# Altium project PCB-Tester-Board-V1.PrjPcb (part 2 of 4)

## Sheet PSU3.SchDoc: PCB-Tester PSU3
size A4; Date: JUN 2020; CheckedBy: Moerz, Hoeren; Author: Rudziński; CompanyName: TDK-Micronas GmbH; DrawnBy: Rudziński; Engineer: Rudziński; Organization: Test Engineering; Address1: Hans-Bunte-Strasse 19; Address2: D-79108 Freiburg; Address3: Germany; DocumentNumber: U33110; Revision: V1.0; SheetNumber: 15; SheetTotal: 18; DateDraw: JUN 2020; DateChecked: 2020-06-19; Workspace: Workspace; TitleTyp: Title-Typ; PageSetup: Record=PageOptions|CenterHorizontal=True|CenterVertical=True|PrintScale=0.97|XCorrection=1.00|YCorrection=1.00|PrintKind=0|BorderSize=5000000|LeftOffset=0|BottomOffset=0|Orientation=2|PaperLength=1000|PaperWidth=1000|Scale=100|PaperSource=7|PrintQuality=-3|MediaType=1|DitherType=10|PrintScaleMode=1|PaperKind=A4|PaperIndex=9
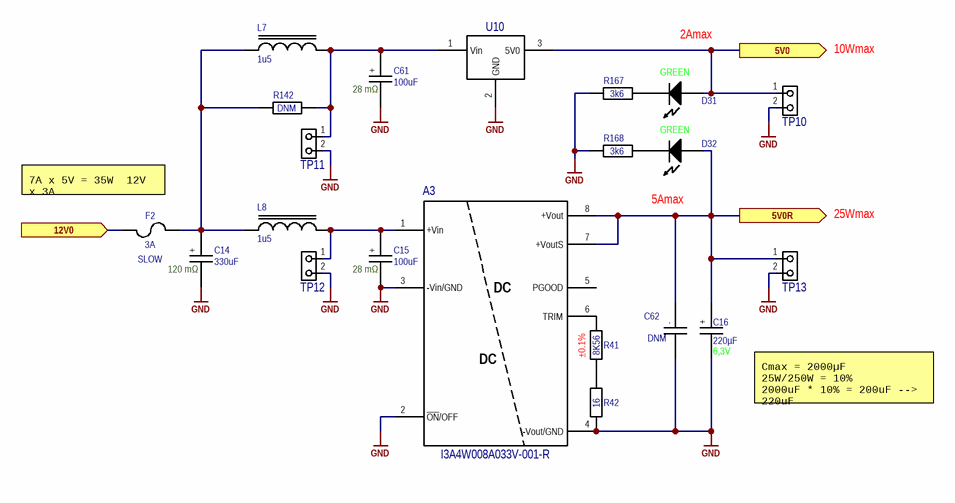
[diagram p5: PSU3.SchDoc]

### Parts
A3  A  [I3A-POSETIVE]  (value not drawn)
C14  value 330uF  ESR: 120 mΩ  [SMD-CAP-ALU-G]  (hidden comment: C+)
C15  value 100uF  ESR: 28 mΩ  [SMD-CAP-ALU-G]  (hidden comment: C+)
C16  value 220µF  Voltage Rating: 6,3V  [SMD-CAP-ALU-E]  (hidden comment: C+)
C61  value 100uF  ESR: 28 mΩ  [SMD-CAP-ALU-G]  (hidden comment: C+)
C62  value DNM  [C0402 Reflow]  (hidden comment: C)  (no BOM)
D31  Color: GREEN  [L0603G]  (hidden comment: D)
D32  Color: GREEN  [L0603G]  (hidden comment: D)
F2  value 3A  Speed: SLOW  [OMNI-Fuse]  (hidden comment: F)
L7  Inductance: 1u5  [XAL4020]  (hidden comment: L)
L8  Inductance: 1u5  [XAL4020]  (hidden comment: L)
R41  value 8K56  Tolerance: ±0.1%  [R0603 Reflow]  (hidden comment: R)
R42  value 16  [R0603 Reflow]  (hidden comment: R)
R142  value DNM  [R1206 Reflow]  (hidden comment: R)  (no BOM)
R167  value 3k6  [R0603 Reflow]  (hidden comment: R)
R168  value 3k6  [R0603 Reflow]  (hidden comment: R)
TP10  TP  [DualTestpoint 100mils]  (value not drawn)  (no BOM)
TP11  TP  [DualTestpoint 100mils]  (value not drawn)  (no BOM)
TP12  TP  [DualTestpoint 100mils]  (value not drawn)  (no BOM)
TP13  TP  [DualTestpoint 100mils]  (value not drawn)  (no BOM)
U10  U  [3SIP Traco]  (value not drawn)

### Ports
5V0 (out), 5V0R (out), 12V0 (in)

### Nets
5V0: D31.1(Anode) TP10.1 U10.3(5V0) ; port 5V0
5V0R: A3.7(+VoutS) A3.8(+Vout) C16.1 C62.1 D32.1(Anode) TP13.1 ; port 5V0R
12V0: F2.1 ; port 12V0
GND: A3.2(~{ON}/OFF) A3.3(-Vin/GND) A3.4(-Vout/GND) C14.2 C15.2 C16.2 C61.2 C62.2 R42.1 R167.1 R168.1 TP10.2 TP11.2 TP12.2 TP13.2 U10.2(GND)
NetA3_1: A3.1(+Vin) C15.1 L8.1 TP12.1
NetA3_6: A3.6(TRIM) R41.2
NetC14_1: C14.1 F2.2 L7.2 L8.2 R142.1
NetC61_1: C61.1 L7.1 R142.2 TP11.1 U10.1(Vin)
NetD31_2: D31.2(Cathode) R167.2
NetD32_2: D32.2(Cathode) R168.2
NetR41_1: R41.1 R42.2

Not connected (* = marked no-connect by the designer): A3 5(PGOOD)

### Notes on the sheet
- 2Amax
- 10Wmax
- (near F2) 7A x 5V = 35W  12V x 3A
- 5Amax
- 25Wmax
- (near C16) Cmax = 2000µF
  25W/250W = 10%
  2000uF * 10% = 200uF --> 220uF
- designed by
- reviewed by
- last drawn by
- Project:
- Schematic:
- last printed
- DIN-A4 L
- sheets
- of
- File:
- (in symbol C) .
- (in symbol C+) +
- (in symbol i3A4W008A033V-001-R) DC

### Library data of the parts
A3 = i3A4W008A033V-001-R: DC DC CONVERTER 3.3-16.5V; 04. Manufacturer: TDK-Lambda Americas Inc.; 03. Unit Price: 20.58; 13. Created Date/Name: AUG 2018 / Hören; 01. Distributor: DigiKey; 02. Distributor Part Number: 285-2720-ND; 07. Manufacturer  Part Number: I3A4W008A033V-001-R; 11. RoHS: YES; ComponentLink1Description: Info; ComponentLink1URL: https://www.digikey.de/products/en?keywords=I3A4W008A033V-001-R; ComponentLink2Description: DataSheet; ComponentLink2URL: https://www.us.tdk-lambda.com/ftp/specs/i3a_full_datasheet.pdf?ref_disty=digikey; NicName: I3A4W008A033V-001-R
C14 = C+: CAP ALUM 330UF 20% 50V SMD; 04. Manufacturer: Panasonic Electronic Components; 07. Manufacturer  Part Number: EEE-FT1H331AP; 03. Unit Price: 0.96; 13. Created Date/Name: AUG2018/Hören; 3D-Export: No; ComponentLink1Description: Info; ComponentLink1URL: https://www.digikey.de/product-detail/en/panasonic-electronic-components/EEE-FT1H331AP/PCE5026DKR-ND/2652105; Tolerance: ±20%; Voltage Rating: 50V; 02. Distributor Part Number: PCE5026DKR-ND; 09. Operating Temperature: -55°C ~ 105°C; 11. RoHS: YES; 01. Distributor: DigiKey; ComponentLink2Description: DataSheet; ComponentLink2URL: https://industrial.panasonic.com/cdbs/www-data/pdf/RDE0000/ABA0000C1240.pdf
C15 C61 = C+: CAP ALUM POLY HYB 100UF 50V SMD; 04. Manufacturer: Panasonic Electronic Components; 07. Manufacturer  Part Number: EEH-ZA1H101P; Tolerance: ±20%; 03. Unit Price: 2.5; 13. Created Date/Name: AUG2018/Hören; 3D-Export: No; ComponentLink1Description: Info; ComponentLink1URL: https://www.digikey.de/product-detail/en/panasonic-electronic-components/EEH-ZA1H101P/P15442DKR-ND/3088152; Voltage Rating: 50V; 02. Distributor Part Number: P15442DKR-ND; 09. Operating Temperature: -55°C ~ 105°C; 11. RoHS: YES; 01. Distributor: DigiKey; ComponentLink2Description: DataSheet; ComponentLink2URL: https://industrial.panasonic.com/cdbs/www-data/pdf/RDD0000/ABA0000C1221.pdf
C16 = C+: CAP ALUM 220UF 20% 6.3V SMD; 04. Manufacturer: Panasonic Electronic Components; 07. Manufacturer  Part Number: EEE-FC0J221P; ESR: 400 mΩ; Type: Radial, Can - SMD; 03. Unit Price: 0.57; 13. Created Date/Name: AUG2018/Hören; Lifetime @ Temp: 1000 Hrs @ 105°C; 3D-Export: No; ComponentLink1Description: Info; ComponentLink1URL: https://www.digikey.de/product-detail/en/panasonic-electronic-components/EEE-FC0J221P/PCE3985DKR-ND/1806511; Tolerance: ±20%; 02. Distributor Part Number: PCE3985DKR-ND; 09. Operating Temperature: -40°C ~ 105°C; 11. RoHS: YES; 01. Distributor: DigiKey; ComponentLink2Description: DataSheet; ComponentLink2URL: https://industrial.panasonic.com/cdbs/www-data/pdf/RDE0000/ABA0000C1172.pdf; Package: Ø8mm x 6.2mm
C62 = C: CAP CER 0.1UF 16V X7R 0402; 04. Manufacturer: KEMET; 07. Manufacturer  Part Number: C0402C104J4RACTU; Tolerance: ±5%; 03. Unit Price: 0.45; 13. Created Date/Name: AUG2018/Hören; Voltage Rating: 16V; Type: X7R; ComponentLink1Description: Info; ComponentLink1URL: https://www.digikey.de/product-detail/en/kemet/C0402C104J4RACTU/399-7761-6-ND/3472292; 02. Distributor Part Number: 399-7761-6-ND; 09. Operating Temperature: -55°C ~ 125°C; 11. RoHS: YES; 01. Distributor: DigiKey; ComponentLink2Description: DataSheet; ComponentLink2URL: https://content.kemet.com/datasheets/KEM_C1002_X7R_SMD.pdf; Package: 0402
D31 D32 = LED: LED GREEN DIFFUSED 0603 SMD; 04. Manufacturer: OSRAM Opto Semiconductors Inc.; 07. Manufacturer  Part Number: LG L29K-G2J1-24-Z; Vf: 1.7V; If: 2mA; Wave Length: 570nm; Viewing Angle: 160°; 03. Unit Price: 0.4; 13. Created Date/Name: AUG2018/Hören; ComponentLink1Description: Info; ComponentLink1URL: https://www.digikey.de/products/en?keywords=475-2709-6-ND; ComponentLink2Description: DataSheet; ComponentLink2URL: https://www.digikey.de/products/en?keywords=475-2709-6-ND; 02. Distributor Part Number: 475-2709-6-ND; 11. RoHS: YES; 01. Distributor: DigiKey
F2 = Fuse: FUSE BOARD MNT 3A 125VAC/VDC SMD; 04. Manufacturer: Littelfuse Inc.; 07. Manufacturer  Part Number: 0154003.DRTL; 03. Unit Price: 2.84; 13. Created Date/Name: AUG 2018 / Hören; 3D-Export: No; 01. Distributor: DigiKey; 02. Distributor Part Number: F10747DKR-ND; 09. Operating Temperature: -55°C ~ 125°C; 11. RoHS: YES; ComponentLink1Description: Info; ComponentLink1URL: https://www.digikey.de/product-detail/en/littelfuse-inc/0154003.DRTL/F10747DKR-ND/8109626; ComponentLink2Description: DataSheet; ComponentLink2URL: https://www.littelfuse.com/~/media/electronics/datasheets/fuses/littelfuse_fuse_154_154t_154l_154tl_datasheet.pdf.pdf
L7 L8 = INDUCTOR: Fixed Inductors 1.5uH Shld 20% 7.5A 23.6mOhms AECQ2; 04. Manufacturer: Coilcraft; 07. Manufacturer  Part Number: XAL4020-152MEC; Impedance Tolerance: %; 03. Unit Price: 1.75; ComponentLink1Description: Info; ComponentLink1URL: https://www.digikey.de/products/en?keywords=732-1620-6-ND; ComponentLink2Description: DataSheet; ComponentLink2URL: https://www.we-online.de/katalog/datasheet/742792040.pdf; 02. Distributor Part Number: 994-XAL4020-152MEC; 11. RoHS: YES; Tolerance: *; Value: *; 01. Distributor: Mouser
R41 = R: RES 8.56K OHM 0.1% 1/8W 0603; 04. Manufacturer: Vishay Dale; 07. Manufacturer  Part Number: TNPW06038K56BEEA; 03. Unit Price: 0.56; 13. Created Date/Name: AUG2018/Hören; Power Rating: 125mW; 3D-Export: No; ComponentLink1URL: https://www.digikey.de/products/en/resistors/chip-resistor-surface-mount/52?k=&pkeyword=&sv=0&pv2085=u8.56+kOhms&pv3=370&sf=0&FV=ffe00034%2C1c00f3%2C1f140000&quantity=&ColumnSort=0&page=1&pageSize=25; ComponentLink1Description: Info; 02. Distributor Part Number: 541-4554-6-ND; 09. Operating Temperature: -55°C ~ 155°C; 11. RoHS: YES; 01. Distributor: DigiKey; ComponentLink2Description: DataSheet; ComponentLink2URL: http://www.vishay.com/docs/28758/tnpw_e3.pdf; Type: Thin Film; Package: 0603
R42 = R: RES SMD 16 OHM 1% 1/10W 0603; 04. Manufacturer: Yageo; 07. Manufacturer  Part Number: RC0603FR-0716RL; 03. Unit Price: 0.09; 13. Created Date/Name: AUG2018/Hören; Power Rating: 100mW; 3D-Export: No; Tolerance: ±1%; ComponentLink1URL: https://www.digikey.de/product-detail/en/yageo/RC0603FR-0716RL/311-16.0HRDKR-ND/732858; ComponentLink1Description: Info; 02. Distributor Part Number: 311-16.0HRDKR-ND; 09. Operating Temperature: -55°C ~ 155°C; 11. RoHS: YES; 01. Distributor: DigiKey; ComponentLink2Description: DataSheet; ComponentLink2URL: http://www.yageo.com/documents/recent/PYu-RC_Group_51_RoHS_L_10.pdf; Type: Thick Film; Package: 0603
R142 = R_25: RES SMD 0 OHM JUMPER 1206; ComponentLink1URL: https://www.digikey.de/products/en?keywords=311-0.0JRDKR-ND; ComponentLink1Description: Info; 11. RoHS: YES; ComponentLink2Description: DataSheet; Package: 1206
R167 R168 = R: RES SMD 3.6K OHM 1% 1/10W 0603; 04. Manufacturer: Yageo; 07. Manufacturer  Part Number: RC0603FR-073K6L; 03. Unit Price: 0.09; 13. Created Date/Name: AUG2018/Hören; Power Rating: 63mW; Tolerance: ±1%; ComponentLink1URL: https://www.digikey.de/product-detail/en/yageo/RC0402FR-071K65L/YAG3043DKR-ND/5282914; ComponentLink1Description: Info; 02. Distributor Part Number: 311-3.60KHRCT-ND; 09. Operating Temperature: -55°C ~ 155°C; 11. RoHS: YES; 01. Distributor: DigiKey; ComponentLink2Description: DataSheet; Type: Thick Film; Package: 0402
TP10-TP13 = DualTestpoint 100mils: as TP3 on sheet Power; 01. Distributor: Samtec Inc.; 02. Distributor Part Number: HMTSW-103-07-G-S-240; 11. RoHS: YES; ComponentLink1Description: Info; ComponentLink1URL: https://www.samtec.com/products/hmtsw-103-07-g-s-240; ComponentLink2Description: DataSheet; ComponentLink2URL: http://suddendocs.samtec.com/catalog_english/hmtsw.pdf
U10 = TSR 2-2450: DC DC CONVERTER 5V 10W; 04. Manufacturer: Traco Power; 03. Unit Price: 11.31; 13. Created Date/Name: AUG 2018 / Hören; 01. Distributor: DigiKey; 02. Distributor Part Number: 1951-2692-ND; 07. Manufacturer  Part Number: TSR 2-2450; 11. RoHS: YES; ComponentLink1Description: Info; ComponentLink1URL: https://www.digikey.de/products/en/power-supplies-board-mount/dc-dc-converters/922?k=TSR2&k=&pkeyword=TSR2&sv=0&pv1525=249171&sf=0&FV=-8%7C922&quantity=&ColumnSort=0&page=1&pageSize=25; ComponentLink2Description: DataSheet; ComponentLink2URL: https://www.tracopower.com/products/tsr2.pdf; Package: 3SIP

## Sheet DC-Cable.SchDoc: PCB-Tester ADC
size A4; Date: JUN 2020; CheckedBy: Moerz, Hoeren; Author: Rudziński; CompanyName: TDK-Micronas GmbH; DrawnBy: Rudziński; Engineer: Rudziński; Organization: Test Engineering; Address1: Hans-Bunte-Strasse 19; Address2: D-79108 Freiburg; Address3: Germany; DocumentNumber: U33110; Revision: V1.0; SheetNumber: 5; SheetTotal: 20; DateDraw: JUN 2020; DateChecked: 2020-06-19; Workspace: Workspace; TitleTyp: Title-Typ; PageSetup: Record=PageOptions|CenterHorizontal=True|CenterVertical=True|PrintScale=0.97|XCorrection=1.00|YCorrection=1.00|PrintKind=0|BorderSize=5000000|LeftOffset=0|BottomOffset=0|Orientation=2|PaperLength=1000|PaperWidth=1000|Scale=100|PaperSource=7|PrintQuality=-3|MediaType=1|DitherType=10|PrintScaleMode=1|PaperKind=A4|PaperIndex=9

### Notes on the sheet
- designed by
- reviewed by
- last drawn by
- Project:
- Schematic:
- last printed
- DIN-A4 L
- sheets
- of
- File:

## Sheet AC-Cable.SchDoc: PCB-Tester ADC
size A4; Date: JUN 2020; CheckedBy: Moerz, Hoeren; Author: Rudziński; CompanyName: TDK-Micronas GmbH; DrawnBy: Rudziński; Engineer: Rudziński; Organization: Test Engineering; Address1: Hans-Bunte-Strasse 19; Address2: D-79108 Freiburg; Address3: Germany; DocumentNumber: U33110; Revision: V1.0; SheetNumber: 3; SheetTotal: 18; DateDraw: JUN 2020; DateChecked: 2020-06-19; Workspace: Workspace; TitleTyp: Title-Typ; PageSetup: Record=PageOptions|CenterHorizontal=True|CenterVertical=True|PrintScale=0.97|XCorrection=1.00|YCorrection=1.00|PrintKind=0|BorderSize=5000000|LeftOffset=0|BottomOffset=0|Orientation=2|PaperLength=1000|PaperWidth=1000|Scale=100|PaperSource=7|PrintQuality=-3|MediaType=1|DitherType=10|PrintScaleMode=1|PaperKind=A4|PaperIndex=9

### Notes on the sheet
- designed by
- reviewed by
- last drawn by
- Project:
- Schematic:
- last printed
- DIN-A4 L
- sheets
- of
- File:

## Sheet RelayExtension.SchDoc: PCB-Tester Relay Extension
size A4; Date: JUN 2020; CheckedBy: Moerz, Hoeren; Author: Rudziński; CompanyName: TDK-Micronas GmbH; DrawnBy: Rudziński; Engineer: Rudziński; Organization: Test Engineering; Address1: Hans-Bunte-Strasse 19; Address2: D-79108 Freiburg; Address3: Germany; DocumentNumber: U33110; Revision: V1.0; SheetNumber: 19; SheetTotal: 20; DateDraw: JUN 2020; DateChecked: 2020-06-19; Workspace: Workspace; TitleTyp: Title-Typ; PageSetup: Record=PageOptions|CenterHorizontal=True|CenterVertical=True|PrintScale=0.97|XCorrection=1.00|YCorrection=1.00|PrintKind=0|BorderSize=5000000|LeftOffset=0|BottomOffset=0|Orientation=2|PaperLength=1000|PaperWidth=1000|Scale=100|PaperSource=7|PrintQuality=-3|MediaType=1|DitherType=10|PrintScaleMode=1|PaperKind=A4|PaperIndex=9
Used 9 times, as channels RE2, RE3, RE4, RE5, RE6, RE7, RE8, RE1, RE9. Parts and nets are listed once, with the designators drawn on the sheet.
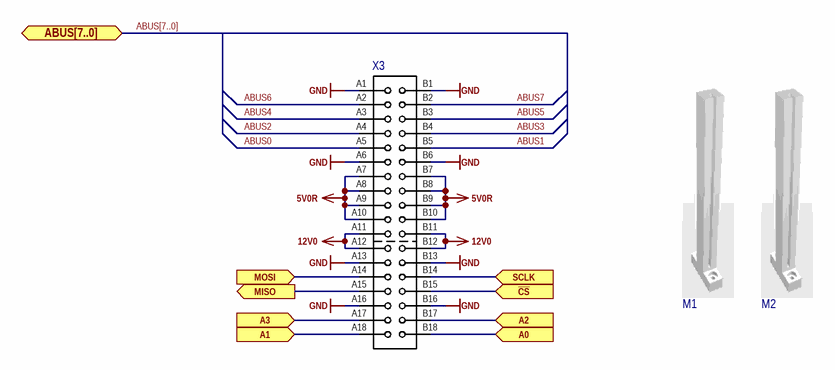
[diagram p6: RelayExtension.SchDoc]

### Parts
M1  PCB Support  [PCB Tester Support]  (value not drawn)
M2  PCB Support  [PCB Tester Support]  (value not drawn)
X3  X  [PCIE-036-02-F-D-TH]  (value not drawn)

### Ports
A0 (in), A1 (in), A2 (in), A3 (in), ABUS[7..0] (bidir), MISO (out), MOSI (in), SCLK (in), ~{CS} (in)

### Nets
5V0R: X3.A7 X3.A8 X3.A9 X3.A10 X3.B7 X3.B8 X3.B9 X3.B10
12V0: X3.A11 X3.A12 X3.B11 X3.B12
GND: X3.A1 X3.A6 X3.A13 X3.A16 X3.B1 X3.B6 X3.B13 X3.B16
~{CS}: X3.B15 ; port ~{CS}
A0: X3.B18 ; port A0
A1: X3.A18 ; port A1
A2: X3.B17 ; port A2
A3: X3.A17 ; port A3
ABUS0: X3.A5  [project net ABUS0_19]
ABUS1: X3.B5  [project net ABUS1_19]
ABUS2: X3.A4  [project net ABUS2_19]
ABUS3: X3.B4  [project net ABUS3_19]
ABUS4: X3.A3  [project net ABUS4_19]
ABUS5: X3.B3  [project net ABUS5_19]
ABUS6: X3.A2  [project net ABUS6_19]
ABUS7: X3.B2  [project net ABUS7_19]
MISO: X3.A15 ; port MISO
MOSI: X3.A14 ; port MOSI
SCLK: X3.B14 ; port SCLK

### Channels
RE2: designators end in _1; ports A0=GND A1=3V3RPI A2=GND A3=GND MISO=MISO MOSI=MOSI SCLK=SCLK ~{CS}=~{CS3}
RE3: designators end in _2; ports A0=3V3RPI A1=3V3RPI A2=GND A3=GND MISO=MISO MOSI=MOSI SCLK=SCLK ~{CS}=~{CS4}
RE4: designators end in _3; ports A0=GND A1=GND A2=3V3RPI A3=GND MISO=MISO MOSI=MOSI SCLK=SCLK ~{CS}=~{CS5}
RE5: designators end in _4; ports A0=3V3RPI A1=GND A2=3V3RPI A3=GND MISO=MISO MOSI=MOSI SCLK=SCLK ~{CS}=~{CS6}
RE6: designators end in _5; ports A0=GND A1=3V3RPI A2=3V3RPI A3=GND MISO=MISO MOSI=MOSI SCLK=SCLK ~{CS}=~{CS7}
RE7: designators end in _6; ports A0=3V3RPI A1=3V3RPI A2=3V3RPI A3=GND MISO=MISO MOSI=MOSI SCLK=SCLK ~{CS}=~{CS8}
RE8: designators end in _7; ports A0=GND A1=GND A2=GND A3=3V3RPI MISO=MISO MOSI=MOSI SCLK=SCLK ~{CS}=~{CS9}
RE1: designators end in _8; ports A0=3V3RPI A1=GND A2=GND A3=GND MISO=MISO MOSI=MOSI SCLK=SCLK ~{CS}=~{CS2}
RE9: designators end in _9; ports A0=3V3RPI A1=GND A2=GND A3=3V3RPI MISO=MISO MOSI=MOSI SCLK=SCLK ~{CS}=~{CS10}

### Buses and harness runs
bus ABUS[7..0] = port ABUS[7..0]

### Notes on the sheet
- designed by
- reviewed by
- last drawn by
- Project:
- Schematic:
- last printed
- DIN-A4 L
- sheets
- of
- File:

### Library data of the parts
M1 M2 = PCB Tester Support: 04. Manufacturer: Likom; 07. Manufacturer  Part Number: TBD; 03. Unit Price: 15.0; 13. Created Date/Name: ??? / Hören; System: Connector; 01. Distributor: N/A; 02. Distributor Part Number: N/A; ComponentLink1Description: Info; ComponentLink2Description: DataSheet
X3 = PCIE-036-02-F-D-TH: CONN PCI EXP FMALE 36POS 0.039; 04. Manufacturer: Samtec Inc.; 03. Unit Price: 1.76; 13. Created Date/Name: ??? / Hören; System: Connector; 01. Distributor: DigiKey; 02. Distributor Part Number: SAM10625-ND; 07. Manufacturer  Part Number: PCIE-036-02-F-D-TH; ComponentLink1Description: Info; ComponentLink1URL: https://www.digikey.de/products/en?keywords=PCIE-036-02-F-D-TH; ComponentLink2Description: DataSheet; ComponentLink2URL: http://suddendocs.samtec.com/catalog_english/pcie.pdf

## Sheet Controller.SchDoc: PCB-Tester Controller
size A4; Date: JUN 2020; CheckedBy: Moerz, Hoeren; Author: Rudziński; CompanyName: TDK-Micronas GmbH; DrawnBy: Rudziński; Engineer: Rudziński; Organization: Test Engineering; Address1: Hans-Bunte-Strasse 19; Address2: D-79108 Freiburg; Address3: Germany; DocumentNumber: U33110; Revision: V1.0; SheetNumber: 2; SheetTotal: 20; DateDraw: JUN 2020; DateChecked: 2020-06-19; Workspace: Workspace; TitleTyp: Title-Typ; PageSetup: Record=PageOptions|CenterHorizontal=True|CenterVertical=True|PrintScale=0.97|XCorrection=1.00|YCorrection=1.00|PrintKind=0|BorderSize=5000000|LeftOffset=0|BottomOffset=0|Orientation=2|PaperLength=1000|PaperWidth=1000|Scale=100|PaperSource=7|PrintQuality=-3|MediaType=1|DitherType=10|PrintScaleMode=1|PaperKind=A4|PaperIndex=9
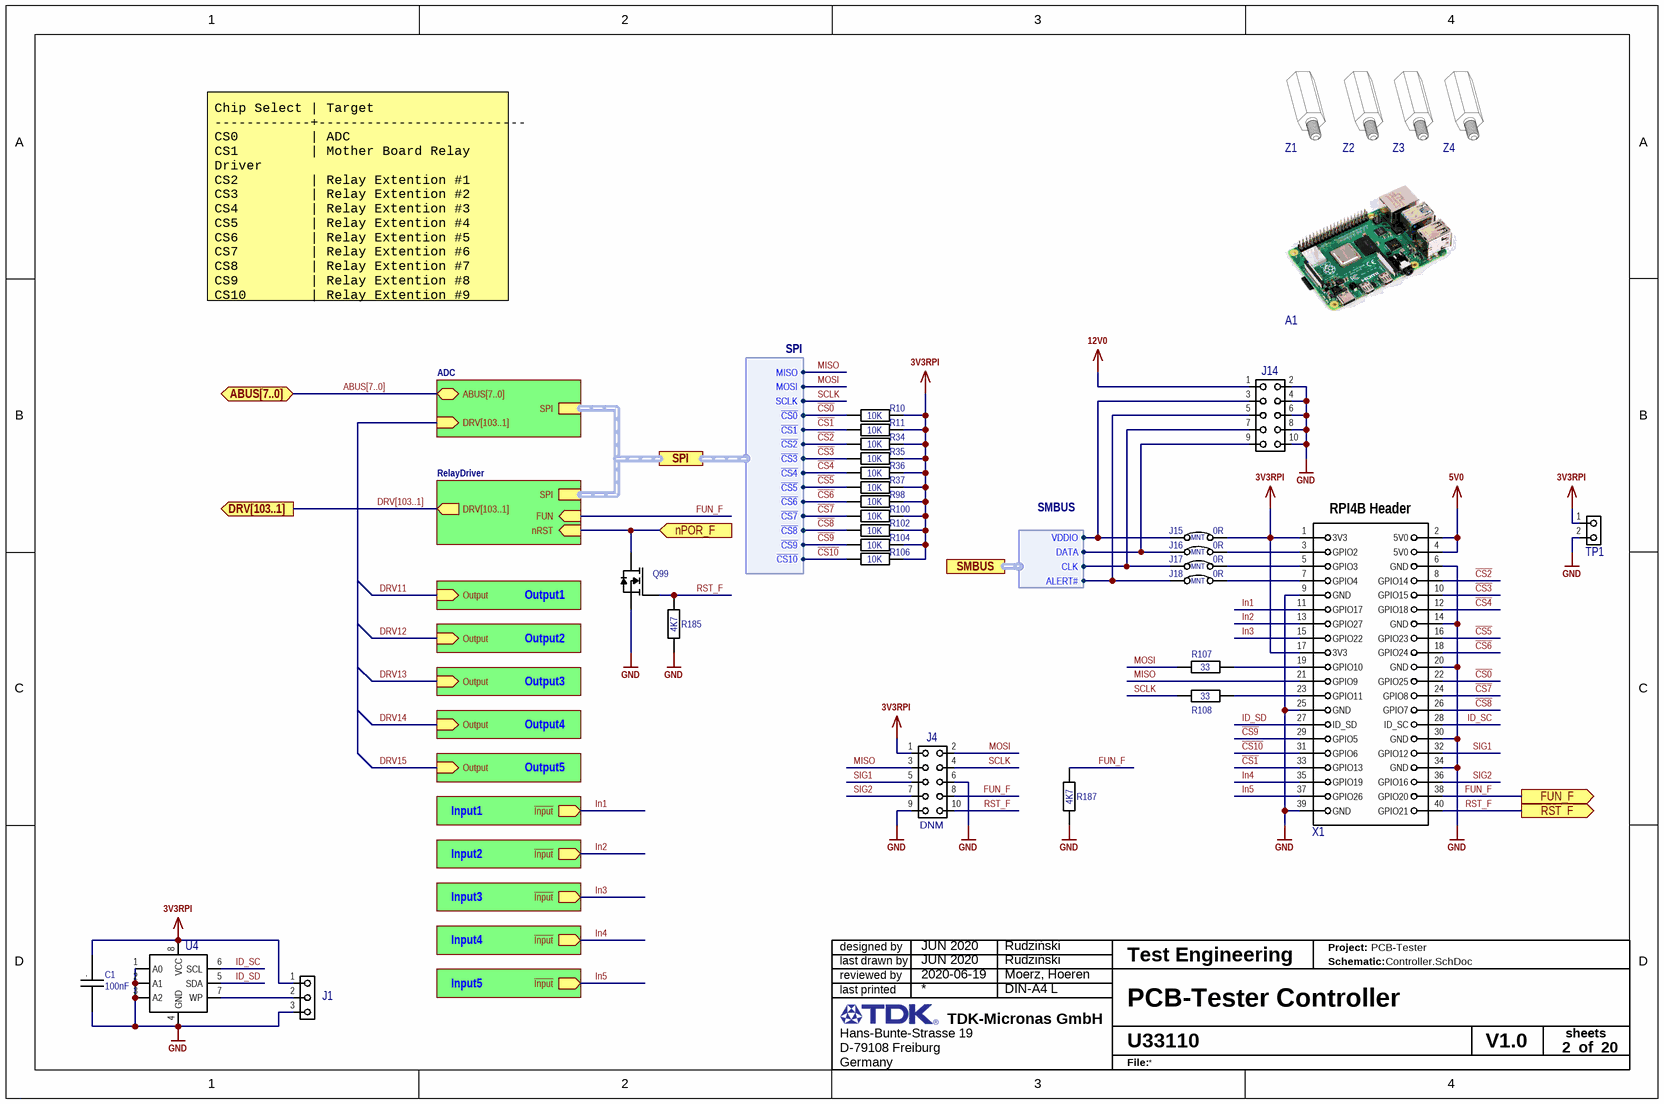
[diagram p7: Controller.SchDoc]

### Parts
A1  A  [RPI4B]  (value not drawn)
C1  value 100nF  [C0402 Reflow]  (hidden comment: C)
J1  J  [Header 100mil 3x1]  (value not drawn)
J4  NicName: DNM  [Header 100mil 5x2]  (hidden comment: J)  (no BOM)
J14  J  [Header 100mil 5x2]  (value not drawn)
J15  value 0R  POPULATED: MNT  [JumperSMD]  (hidden comment: J)  (no BOM)
J16  value 0R  POPULATED: MNT  [JumperSMD]  (hidden comment: J)  (no BOM)
J17  value 0R  POPULATED: MNT  [JumperSMD]  (hidden comment: J)  (no BOM)
J18  value 0R  POPULATED: MNT  [JumperSMD]  (hidden comment: J)  (no BOM)
Q99  Q  [SOT23-3]  (value not drawn)
R10  value 10K  [R0402 Reflow]  (hidden comment: R)
R11  value 10K  [R0402 Reflow]  (hidden comment: R)
R34  value 10K  [R0402 Reflow]  (hidden comment: R)
R35  value 10K  [R0402 Reflow]  (hidden comment: R)
R36  value 10K  [R0402 Reflow]  (hidden comment: R)
R37  value 10K  [R0402 Reflow]  (hidden comment: R)
R98  value 10K  [R0402 Reflow]  (hidden comment: R)
R100  value 10K  [R0402 Reflow]  (hidden comment: R)
R102  value 10K  [R0402 Reflow]  (hidden comment: R)
R104  value 10K  [R0402 Reflow]  (hidden comment: R)
R106  value 10K  [R0402 Reflow]  (hidden comment: R)
R107  value 33  [R0402 Reflow]  (hidden comment: R)
R108  value 33  [R0402 Reflow]  (hidden comment: R)
R185  value 4K7  [R0603 Reflow]  (hidden comment: R)
R187  value 4K7  [R0603 Reflow]  (hidden comment: R)
TP1  TP  [DualTestpoint 100mils]  (value not drawn)  (no BOM)
U4  U  [SOIC8 (R-8)]  (value not drawn)
X1  X  [RPI4B Footprint]  (value not drawn)
Z1  Z  [HSM2.5-6.4-16-2]  (value not drawn)
Z2  Z  [HSM2.5-6.4-16-2]  (value not drawn)
Z3  Z  [HSM2.5-6.4-16-2]  (value not drawn)
Z4  Z  [HSM2.5-6.4-16-2]  (value not drawn)

### Sub-sheets
ADC = ADC.SchDoc: ABUS[7..0] (bidir), SPI (harness SPI), DRV[103..1] (in)
Input = Input.SchDoc: ~{Input} (out)
Input = Input.SchDoc: ~{Input} (out)
Input = Input.SchDoc: ~{Input} (out)
Input = Input.SchDoc: ~{Input} (out)
Input = Input.SchDoc: ~{Input} (out)
Output = Output.SchDoc: Output (in)
Output = Output.SchDoc: Output (in)
Output = Output.SchDoc: Output (in)
Output = Output.SchDoc: Output (in)
Output = Output.SchDoc: Output (in)
RelayDriver = RelayDriver.SchDoc: SPI (harness SPI), DRV[103..1] (out), nRST (in), FUN (in)

### Ports
ABUS[7..0] (bidir), DRV[103..1] (out), FUN_F (out), nPOR_F (in), RST_F (out), SMBUS (harness SMBUS), SPI (harness SPI)

### Harnesses
SPI: MISO, MOSI, SCLK, ~{CS0}, ~{CS1}, ~{CS2}, ~{CS3}, ~{CS4}, ~{CS5}, ~{CS6}, ~{CS7}, ~{CS8}, ~{CS9}, ~{CS10}
SMBUS: ALERT#, CLK, DATA, VDDIO

### Nets
3V3RPI: C1.1 J1.1 J4.1 J15.2 R10.2 R11.2 R34.2 R35.2 R36.2 R37.2 R98.2 R100.2 R102.2 R104.2 R106.2 TP1.1 U4.8(VCC) X1.1(3V3) X1.17(3V3)
5V0: X1.2(5V0) X1.4(5V0)
12V0: J14.1
GND: C1.2 J1.3 J4.6 J4.9 J14.2 J14.4 J14.6 J14.8 J14.10 Q99.2(S) R185.1 R187.1 TP1.2 U4.1(A0) U4.2(A1) U4.3(A2) U4.4(GND) X1.6(GND) X1.9(GND) X1.14(GND) X1.20(GND) X1.25(GND) X1.30(GND) X1.34(GND) X1.39(GND)
~{CS0}: R10.1 X1.22(GPIO25) ; port SPI.~{CS0}
~{CS1}: R11.1 X1.33(GPIO13) ; port SPI.~{CS1}
~{CS2}: R34.1 X1.8(GPIO14) ; port SPI.~{CS2}
~{CS3}: R35.1 X1.10(GPIO15) ; port SPI.~{CS3}
~{CS4}: R36.1 X1.12(GPIO18) ; port SPI.~{CS4}
~{CS5}: R37.1 X1.16(GPIO23) ; port SPI.~{CS5}
~{CS6}: R98.1 X1.18(GPIO24) ; port SPI.~{CS6}
~{CS7}: R100.1 X1.24(GPIO8) ; port SPI.~{CS7}
~{CS8}: R102.1 X1.26(GPIO7) ; port SPI.~{CS8}
~{CS9}: R104.1 X1.29(GPIO5) ; port SPI.~{CS9}
~{CS10}: R106.1 X1.31(GPIO6) ; port SPI.~{CS10}
FUN_F: J4.8 R187.2 X1.38(GPIO20) ; port FUN_F, sheet RelayDriver/FUN
ID_SC: U4.6(SCL) X1.28(ID_SC)  [project net ID_SC_2]
ID_SD: U4.5(SDA) X1.27(ID_SD)  [project net ID_SD_2]
In1: X1.11(GPIO17) ; sheet Input/~{Input}
In2: X1.13(GPIO27) ; sheet Input/~{Input}
In3: X1.15(GPIO22) ; sheet Input/~{Input}
In4: X1.35(GPIO19) ; sheet Input/~{Input}
In5: X1.37(GPIO26) ; sheet Input/~{Input}
MISO: J4.3 X1.21(GPIO9) ; port SPI.MISO
MOSI: J4.2 R107.1 ; port SPI.MOSI
nPOR_F: Q99.3(D) ; port nPOR_F, sheet RelayDriver/nRST
RST_F: J4.10 Q99.1(G) R185.2 X1.40(GPIO21) ; port RST_F
SCLK: J4.4 R108.1 ; port SPI.SCLK
SIG1: J4.5 X1.32(GPIO12)  [project net SIG1_2]
SIG2: J4.7 X1.36(GPIO16)  [project net SIG2_2]
NetC53_1: J14.3 J15.1 ; port SMBUS.VDDIO
NetJ1_2: J1.2 U4.7(WP)
NetJ14_5: J14.5 J18.1 ; port SMBUS.ALERT#
NetJ14_7: J14.7 J17.1 ; port SMBUS.CLK
NetJ14_9: J14.9 J16.1 ; port SMBUS.DATA
NetJ16_2: J16.2 X1.3(GPIO2)
NetJ17_2: J17.2 X1.5(GPIO3)
NetJ18_2: J18.2 X1.7(GPIO4)
NetR107_2: R107.2 X1.19(GPIO10)
NetR108_2: R108.2 X1.23(GPIO11)

### Buses and harness runs
bus ABUS[7..0] = port ABUS[7..0] = sheet ADC/ABUS[7..0]
bus DRV[103..1] = port DRV[103..1] = sheet ADC/DRV[103..1] = sheet RelayDriver/DRV[103..1]
harness port SPI = sheet ADC/SPI = sheet RelayDriver/SPI

### Notes on the sheet
- Chip Select | Target
  ------------+--------------------------
  CS0         | ADC
  CS1         | Mother Board Relay Driver
  CS2         | Relay Extention #1
  CS3         | Relay Extention #2
  CS4         | Relay Extention #3
  CS5         | Relay Extention #4
  CS6         | Relay Extention #5
  CS7         | Relay Extention #6
  CS8         | Relay Extention #7
  CS9         | Relay Extention #8
  CS10        | Relay Extention #9
- Output1
- Output2
- Output3
- Output4
- Output5
- Input1
- Input2
- Input3
- Input4
- Input5
- designed by
- reviewed by
- last drawn by
- Project:
- Schematic:
- last printed
- DIN-A4 L
- sheets
- of
- File:
- (in symbol C) .
- (in symbol RPI4B Footprint) RPI4B Header

### Library data of the parts
A1 = RPI4B: RASPBERRY PI 4 MODEL B 4GB SDRAM; 07. Manufacturer  Part Number: RASPBERRY PI 4B/4GB; 03. Unit Price: 60.53; 13. Created Date/Name: ??? / Hören; 01. Distributor: DigiKey; 02. Distributor Part Number: 1690-RASPBERRYPI4B/4GB-ND; 04. Manufacturer: Raspberry Pi; ComponentLink1Description: Info; ComponentLink1URL: https://www.digikey.de/products/en/development-boards-kits-programmers/evaluation-boards-embedded-mcu-dsp/786?k=Raspberry&k=&pkeyword=Raspberry&sv=0&pv1742=392511&sf=0&FV=-8%7C786&quantity=&ColumnSort=0&page=1&pageSize=25; ComponentLink2Description: DataSheet; ComponentLink2URL: https://www.raspberrypi.org/documentation/hardware/raspberrypi/bcm2711/rpi_DATA_2711_1p0_preliminary.pdf
C1 = C: CAP CER 0.1UF 25V X7R 0402; 04. Manufacturer: Yageo; 07. Manufacturer  Part Number: CC0402KRX7R8BB104; Tolerance: ±20%; 03. Unit Price: 0.09; 13. Created Date/Name: AUG2018/Hören; ComponentLink1Description: Info; ComponentLink1URL: *; 02. Distributor Part Number: 311-2077-6-ND; 09. Operating Temperature: -xx..+yy°C; 11. RoHS: ???; 01. Distributor: DigiKey; ComponentLink2Description: DataSheet
J1 = Header 3Pins 100mil: CONN HEADER VERT 3POS 2.54MM; 04. Manufacturer: Samtec Inc.; 07. Manufacturer  Part Number: HMTSW-103-07-G-S-240; 03. Unit Price: 0.25; 13. Created Date/Name: AUG2018/Hören; 01. Distributor: Samtec Inc.; 02. Distributor Part Number: HMTSW-103-07-G-S-240; 11. RoHS: YES; ComponentLink1Description: Info; ComponentLink1URL: https://www.samtec.com/products/hmtsw-103-07-g-s-240; ComponentLink2Description: DataSheet; ComponentLink2URL: http://suddendocs.samtec.com/catalog_english/hmtsw.pdf
J4 = Header 5x2Pins 100mil: 04. Manufacturer: Samtec Inc.; 07. Manufacturer  Part Number: HMTSW-103-07-G-S-240; 03. Unit Price: 0.25; 13. Created Date/Name: AUG2018/Hören; 01. Distributor: Samtec Inc.; 02. Distributor Part Number: HMTSW-103-07-G-S-240; 11. RoHS: YES; ComponentLink1Description: Info; ComponentLink1URL: https://www.samtec.com/products/hmtsw-103-07-g-s-240; ComponentLink2Description: DataSheet; ComponentLink2URL: http://suddendocs.samtec.com/catalog_english/hmtsw.pdf
J14 = Header 5x2Pins 100mil: .100" High-Temp Variable Post Height Terminal Strip; 04. Manufacturer: Samtec Inc.; 07. Manufacturer  Part Number: HMTSW-105-07-G-D-240; 03. Unit Price: 0.843; 13. Created Date/Name: AUG2018/Hören; 01. Distributor: Samtec Inc.; 02. Distributor Part Number: HMTSW-105-07-G-D-240; 11. RoHS: YES; ComponentLink1Description: Info; ComponentLink1URL: https://www.samtec.com/products/hmtsw-103-07-g-s-240; ComponentLink2Description: DataSheet; ComponentLink2URL: http://suddendocs.samtec.com/catalog_english/hmtsw.pdf
J15-J18 = Jumper SMD: RES SMD 0 OHM JUMPER 1/10W 0603; 04. Manufacturer: Yageo; 07. Manufacturer  Part Number: RC0603JR-070RL; 03. Unit Price: 0.09; 01. Distributor: DigiKey; 02. Distributor Part Number: 311-0.0GRDKR-ND; 09. Operating Temperature: -55°C ~ 155°C; 11. RoHS: YES; Package: 0603; ComponentLink4Description: Info; ComponentLink4URL: https://www.digikey.de/product-detail/en/yageo/RC0603JR-070RL/311-0.0GRDKR-ND/732569; ComponentLink5Description: DataSheet; ComponentLink5URL: http://www.yageo.com/documents/recent/PYu-RC_Group_51_RoHS_L_10.pdf
Q99 = FDV303N: as Q77 on sheet Instrument; 01. Distributor: DigiKey; 02. Distributor Part Number: FDV303NDKR-ND; 07. Manufacturer  Part Number: FDV303N; 09. Operating Temperature: -55°C ~ 150°C (TJ); 11. RoHS: YES; ComponentLink1Description: Info; ComponentLink1URL: https://www.digikey.de/product-detail/en/on-semiconductor/FDV303N/FDV303NDKR-ND/1630434; ComponentLink2Description: DataSheet; ComponentLink2URL: https://media.digikey.com/pdf/Data%20Sheets/Fairchild%20PDFs/FDV303N.pdf; Vdss: 25V; Id: 680mA
R10 R11 R34-R37 R98 R100 R102 R104 R106 = R_10: RES SMD 10K OHM 1% 1/16W 0402; 04. Manufacturer: Yageo; 07. Manufacturer  Part Number: RC0402FR-0710KL; 03. Unit Price: 0.09; 13. Created Date/Name: AUG2018/Hören; Power Rating: 63mW; Tolerance: ±1%; ComponentLink1URL: https://www.digikey.de/products/en?keywords=311-10.0KLRDKR-ND; ComponentLink1Description: Info; 02. Distributor Part Number: 311-10.0KLRDKR-ND; 09. Operating Temperature: -55°C ~ 155°C; 11. RoHS: YES; 01. Distributor: DigiKey; ComponentLink2Description: DataSheet; Type: Thick Film; Package: 0402
R107 R108 = R_19: RES SMD 33 OHM 1% 1/16W 0402; 04. Manufacturer: Yageo; 07. Manufacturer  Part Number: RC0402FR-0733RL; 03. Unit Price: 0.09; 13. Created Date/Name: AUG2018/Hören; Power Rating: 63mW; Tolerance: ±1%; ComponentLink1URL: https://www.digikey.de/products/en?keywords=311-33.0LRDKR-ND; ComponentLink1Description: Info; 02. Distributor Part Number: 311-33.0LRDKR-ND; 09. Operating Temperature: -55°C ~ 155°C; 11. RoHS: YES; 01. Distributor: DigiKey; ComponentLink2Description: DataSheet; Type: Thick Film; Package: 0402
R185 R187 = R: as R1 on sheet Instrument; Tolerance: ±1%; ComponentLink1URL: *; ComponentLink1Description: Info; 02. Distributor Part Number: 311-4.70KHRCT-ND; 09. Operating Temperature: -xx..+yy°C; 11. RoHS: ???; 01. Distributor: DigiKey; ComponentLink2Description: DataSheet; Package: *
TP1 = DualTestpoint 100mils: as TP3 on sheet Power; 01. Distributor: Samtec Inc.; 02. Distributor Part Number: HMTSW-103-07-G-S-240; 11. RoHS: YES; ComponentLink1Description: Info; ComponentLink1URL: https://www.samtec.com/products/hmtsw-103-07-g-s-240; ComponentLink2Description: DataSheet; ComponentLink2URL: http://suddendocs.samtec.com/catalog_english/hmtsw.pdf
U4 = 24LC256T-I/SN: IC EEPROM 256K I2C 400KHZ 8SOIC; 04. Manufacturer: Microchip Technology; 03. Unit Price: 0.71; 13. Created Date/Name: AUG 2018 / Hören; 01. Distributor: DigiKey; 02. Distributor Part Number: 24LC256T-I/SNDKR-ND; 07. Manufacturer  Part Number: 24LC256T-I/SN; 11. RoHS: YES; ComponentLink1Description: Info; ComponentLink1URL: https://www.digikey.de/product-detail/en/microchip-technology/24LC256T-I-SN/24LC256T-I-SNDKR-ND/1850685; ComponentLink2Description: DataSheet; ComponentLink2URL: http://ww1.microchip.com/downloads/en/DeviceDoc/24AA256-24LC256-24FC256-Data-Sheet-20001203W.pdf; Package: SOIC8
X1 = RPI4B Footprint: 40 Position Elevated Socket Connector  Through Hole; 04. Manufacturer: Samtec Inc.; 07. Manufacturer  Part Number: ESW-120-23-L-D-LL; 03. Unit Price: 5.34; 13. Created Date/Name: ??? / Hören; 01. Distributor: Samtec; 02. Distributor Part Number: ESW-120-23-L-D-LL; ComponentLink1Description: Info; ComponentLink1URL: https://www.samtec.com/products/esw-120-23-l-d-ll; ComponentLink2Description: DataSheet; ComponentLink2URL: http://suddendocs.samtec.com/catalog_english/esw_th.pdf; System: Connector
Z1-Z4 = HSM2.5-6.4-16-2: HEX STANDOFF M2.5 BRASS 16MM; 04. Manufacturer: Essentra Components; 03. Unit Price: 2.69; 13. Created Date/Name: ??? / Hören; 01. Distributor: DigiKey; 02. Distributor Part Number: HSM2.5-6.4-16-2-ND; 07. Manufacturer  Part Number: HSM2.5-6.4-16-2; ComponentLink1Description: Info; ComponentLink1URL: https://www.digikey.de/products/en/hardware-fasteners-accessories/board-spacers-standoffs/582?k=standoff&k=&pkeyword=standoff&sv=0&pv741=29561&sf=0&FV=29%7C371405%2C1839%7C370197%2C1989%7C0%2C-8%7C582&quantity=&ColumnSort=-1000009&page=1&pageSize=25; ComponentLink2Description: DataSheet; ComponentLink2URL: https://www.essentracomponents.com.sg/images-line/pdfs/HTNSP.pdf

## Sheet ADC.SchDoc: PCB-Tester ADC
size A4; Date: JUN 2020; CheckedBy: Moerz, Hoeren; Author: Rudziński; CompanyName: TDK-Micronas GmbH; DrawnBy: Rudziński; Engineer: Rudziński; Organization: Test Engineering; Address1: Hans-Bunte-Strasse 19; Address2: D-79108 Freiburg; Address3: Germany; DocumentNumber: U33110; Revision: V1.0; SheetNumber: 3; SheetTotal: 18; DateDraw: JUN 2020; DateChecked: 2020-06-19; Workspace: Workspace; TitleTyp: Title-Typ; PageSetup: Record=PageOptions|CenterHorizontal=True|CenterVertical=True|PrintScale=0.97|XCorrection=1.00|YCorrection=1.00|PrintKind=0|BorderSize=5000000|LeftOffset=0|BottomOffset=0|Orientation=2|PaperLength=1000|PaperWidth=1000|Scale=100|PaperSource=7|PrintQuality=-3|MediaType=1|DitherType=10|PrintScaleMode=1|PaperKind=A4|PaperIndex=9
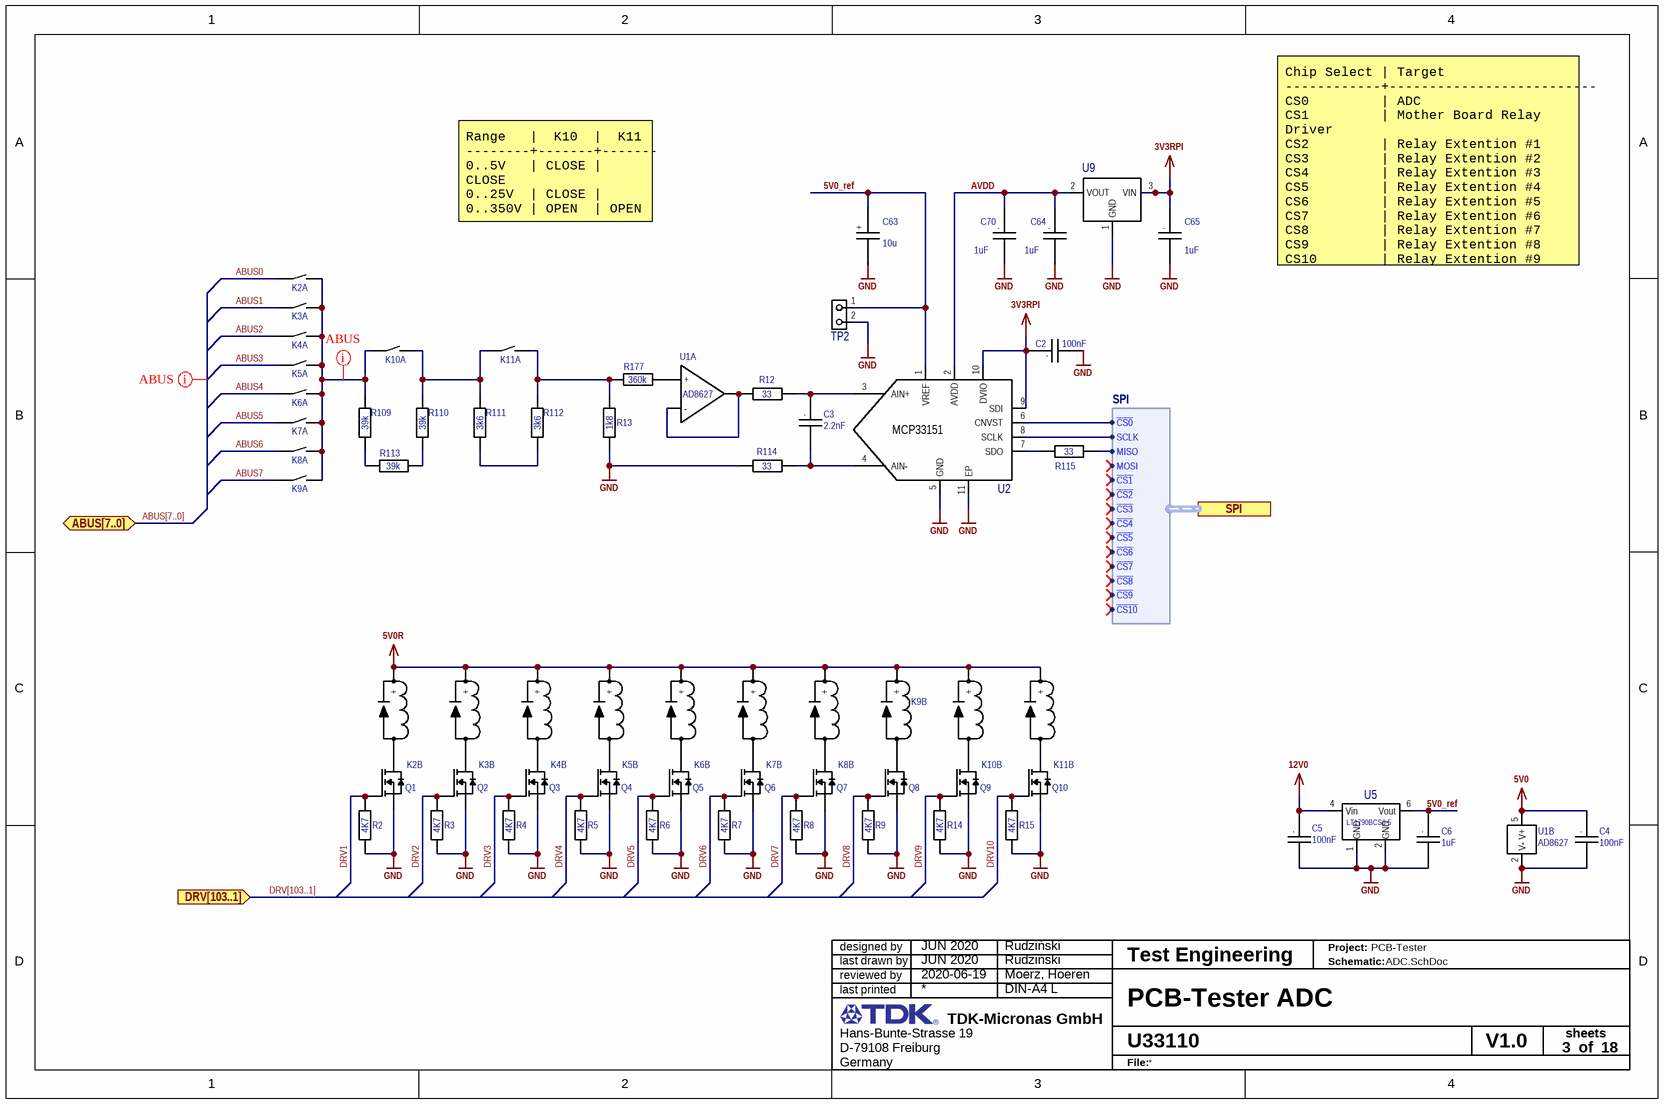
[diagram p8: ADC.SchDoc]

### Parts
C2  value 100nF  [C0402 Reflow]  (hidden comment: C)
C3  value 2.2nF  [C0603 Reflow]  (hidden comment: C)
C4  value 100nF  [C0402 Reflow]  (hidden comment: C)
C5  value 100nF  [C0402 Reflow]  (hidden comment: C)
C6  value 1uF  [C0402 Reflow]  (hidden comment: C)
C63  value 10u  [CAP_TAN_B]  (hidden comment: C+)
C64  value 1uF  [C0402 Reflow]  (hidden comment: C)
C65  value 1uF  [C0402 Reflow]  (hidden comment: C)
C70  value 1uF  [C0402 Reflow]  (hidden comment: C)
K2  K  [118-1A]  (value not drawn)  (parts A,B of 2)
K3  K  [118-1A]  (value not drawn)  (parts A,B of 2)
K4  K  [118-1A]  (value not drawn)  (parts A,B of 2)
K5  K  [118-1A]  (value not drawn)  (parts A,B of 2)
K6  K  [118-1A]  (value not drawn)  (parts A,B of 2)
K7  K  [118-1A]  (value not drawn)  (parts A,B of 2)
K8  K  [118-1A]  (value not drawn)  (parts A,B of 2)
K9  K  [118-1A]  (value not drawn)  (parts A,B of 2)
K10  K  [118-1A]  (value not drawn)  (parts A,B of 2)
K11  K  [118-1A]  (value not drawn)  (parts A,B of 2)
Q1  Q  [SOT23-3]  (value not drawn)
Q2  Q  [SOT23-3]  (value not drawn)
Q3  Q  [SOT23-3]  (value not drawn)
Q4  Q  [SOT23-3]  (value not drawn)
Q5  Q  [SOT23-3]  (value not drawn)
Q6  Q  [SOT23-3]  (value not drawn)
Q7  Q  [SOT23-3]  (value not drawn)
Q8  Q  [SOT23-3]  (value not drawn)
Q9  Q  [SOT23-3]  (value not drawn)
Q10  Q  [SOT23-3]  (value not drawn)
R2  value 4K7  [R0603 Reflow]  (hidden comment: R)
R3  value 4K7  [R0603 Reflow]  (hidden comment: R)
R4  value 4K7  [R0603 Reflow]  (hidden comment: R)
R5  value 4K7  [R0603 Reflow]  (hidden comment: R)
R6  value 4K7  [R0603 Reflow]  (hidden comment: R)
R7  value 4K7  [R0603 Reflow]  (hidden comment: R)
R8  value 4K7  [R0603 Reflow]  (hidden comment: R)
R9  value 4K7  [R0603 Reflow]  (hidden comment: R)
R12  value 33  [R0402 Reflow]  (hidden comment: R)
R13  value 1k8  [R0603 Reflow]  (hidden comment: R)
R14  value 4K7  [R0603 Reflow]  (hidden comment: R)
R15  value 4K7  [R0603 Reflow]  (hidden comment: R)
R109  value 39k  [R2512 Reflow]  (hidden comment: R)
R110  value 39k  [R2512 Reflow]  (hidden comment: R)
R111  value 3k6  [R0603 Reflow]  (hidden comment: R)
R112  value 3k6  [R0603 Reflow]  (hidden comment: R)
R113  value 39k  [R2512 Reflow]  (hidden comment: R)
R114  value 33  [R0402 Reflow]  (hidden comment: R)
R115  value 33  [R0402 Reflow]  (hidden comment: R)
R177  value 360k  [R1206 Reflow]  (hidden comment: R)
TP2  TP  [DualTestpoint 100mils]  (value not drawn)  (no BOM)
U1  U  [SC70-5]  (value not drawn)  (parts A,B of 2)
U2  NicName: MCP33151  [TDFN10EP]  (hidden comment: U)
U5  U  [TSOT23-6(S6)]  (value not drawn)
U9  U  [SOT23-3]  (value not drawn)

### Ports
ABUS[7..0] (bidir), DRV[103..1] (in), SPI (harness SPI)

### Harnesses
SPI: MISO, MOSI, SCLK, ~{CS0}, ~{CS1}, ~{CS2}, ~{CS3}, ~{CS4}, ~{CS5}, ~{CS6}, ~{CS7}, ~{CS8}, ~{CS9}, ~{CS10}

### Nets
3V3RPI: C2.1 C65.1 U2.9(SDI) U2.10(DVIO) U9.3(VIN)
5V0: C4.1 U1.5(V+)
5V0R: K2.1(+) K3.1(+) K4.1(+) K5.1(+) K6.1(+) K7.1(+) K8.1(+) K9.1(+) K10.1(+) K11.1(+)
12V0: C5.1 U5.4(Vin)
GND: C2.2 C4.2 C5.2 C6.2 C63.2 C64.2 C65.2 C70.2 Q1.2(S) Q2.2(S) Q3.2(S) Q4.2(S) Q5.2(S) Q6.2(S) Q7.2(S) Q8.2(S) Q9.2(S) Q10.2(S) R2.1 R3.1 R4.1 R5.1 R6.1 R7.1 R8.1 R9.1 R13.1 R14.1 R15.1 R114.2 TP2.2 U1.2(V-) U2.5(GND) U2.11(EP) U5.1(GND) U5.2(GND) U9.1(GND)
5V0_ref: C6.1 C63.1 TP2.1 U2.1(VREF) U5.6(Vout)  [project net 5V0_ref_3]
~{CS0}: U2.6(CNVST) ; port SPI.~{CS0}
ABUS0: K2.4(CB)
ABUS1: K3.4(CB)
ABUS2: K4.4(CB)
ABUS3: K5.4(CB)
ABUS4: K6.4(CB)
ABUS5: K7.4(CB)
ABUS6: K8.4(CB)
ABUS7: K9.4(CB)
AVDD: C64.1 C70.1 U2.2(AVDD) U9.2(VOUT)  [project net AVDD_3]
DRV1: Q1.1(G) R2.2
DRV2: Q2.1(G) R3.2
DRV3: Q3.1(G) R4.2
DRV4: Q4.1(G) R5.2
DRV5: Q5.1(G) R6.2
DRV6: Q6.1(G) R7.2
DRV7: Q7.1(G) R8.2
DRV8: Q8.1(G) R9.2
DRV9: Q9.1(G) R14.2
DRV10: Q10.1(G) R15.2
MISO: R115.2 ; port SPI.MISO
SCLK: U2.8(SCLK) ; port SPI.SCLK
NetC3_1: C3.1 R12.1 U2.3(AIN+)
NetC3_2: C3.2 R114.1 U2.4(AIN-)
NetK2_2: K2.2(-) Q1.3(D)
NetK2_3: K2.3(CA) K3.3(CA) K4.3(CA) K5.3(CA) K6.3(CA) K7.3(CA) K8.3(CA) K9.3(CA) K10.4(CB) R109.2
NetK3_2: K3.2(-) Q2.3(D)
NetK4_2: K4.2(-) Q3.3(D)
NetK5_2: K5.2(-) Q4.3(D)
NetK6_2: K6.2(-) Q5.3(D)
NetK7_2: K7.2(-) Q6.3(D)
NetK8_2: K8.2(-) Q7.3(D)
NetK9_2: K9.2(-) Q8.3(D)
NetK10_2: K10.2(-) Q9.3(D)
NetK10_3: K10.3(CA) K11.4(CB) R110.2 R111.2
NetK11_2: K11.2(-) Q10.3(D)
NetK11_3: K11.3(CA) R13.2 R112.2 R177.2
NetR12_2: R12.2 U1.1(Out) U1.4(-)
NetR109_1: R109.1 R113.2
NetR110_1: R110.1 R113.1
NetR111_1: R111.1 R112.1
NetR115_1: R115.1 U2.7(SDO)
NetR177_1: R177.1 U1.3(+)

### Buses and harness runs
bus ABUS[7..0] = port ABUS[7..0]
bus DRV[103..1] = port DRV[103..1]

### Layout directives
net class ABUS: (no net found under the mark), NetK2_3

### Notes on the sheet
- Range   |  K10  |  K11
  --------+-------+-------
  0..5V   | CLOSE | CLOSE
  0..25V  | CLOSE |
  0..350V | OPEN  | OPEN
- Chip Select | Target
  ------------+--------------------------
  CS0         | ADC
  CS1         | Mother Board Relay Driver
  CS2         | Relay Extention #1
  CS3         | Relay Extention #2
  CS4         | Relay Extention #3
  CS5         | Relay Extention #4
  CS6         | Relay Extention #5
  CS7         | Relay Extention #6
  CS8         | Relay Extention #7
  CS9         | Relay Extention #8
  CS10        | Relay Extention #9
- designed by
- reviewed by
- last drawn by
- Project:
- Schematic:
- last printed
- DIN-A4 L
- sheets
- of
- File:
- (in symbol C) .
- (in symbol C+_TAN) +

### Library data of the parts
C2 C4 C5 = C: CAP CER 0.1UF 25V X7R 0402; 04. Manufacturer: Yageo; 07. Manufacturer  Part Number: CC0402KRX7R8BB104; Tolerance: ±5%; Voltage Rating: 16V; 03. Unit Price: 0.09; 13. Created Date/Name: AUG2018/Hören; Type: X7R; ComponentLink1Description: Info; ComponentLink1URL: https://www.digikey.de/product-detail/en/kemet/C0402C104J4RACTU/399-7761-6-ND/3472292; 02. Distributor Part Number: 311-2077-6-ND; 09. Operating Temperature: -55°C ~ 125°C; 11. RoHS: YES; 01. Distributor: DigiKey; ComponentLink2Description: DataSheet; ComponentLink2URL: https://content.kemet.com/datasheets/KEM_C1002_X7R_SMD.pdf; Package: 0402
C3 = C: CAP CER 2200PF 50V X7R 0402; 04. Manufacturer: Samsung Electro-Mechanics; 07. Manufacturer  Part Number: CL05B222JB5NNNC; Tolerance: ±5%; 03. Unit Price: 0.09; 13. Created Date/Name: AUG2018/Hören; Voltage Rating: 50V; Type: X7R; ComponentLink1Description: Info; ComponentLink1URL: https://www.digikey.de/product-detail/en/samsung-electro-mechanics/CL05B222JB5NNNC/1276-1532-6-ND/3892046; 02. Distributor Part Number: 1276-1532-6-ND; 09. Operating Temperature: -55°C ~ 125°C; 11. RoHS: YES; 01. Distributor: DigiKey; ComponentLink2Description: DataSheet; Package: 0402
C6 C64 C65 C70 = C: CAP CER 1UF 6.3V X7R 0402; 04. Manufacturer: Murata Electronics; 07. Manufacturer  Part Number: GRM155R70J105KA12J; Tolerance: ±10%; 03. Unit Price: 0.11; 13. Created Date/Name: AUG2018/Hören; Voltage Rating: 6.3V; Type: X7R; ComponentLink1Description: Info; ComponentLink1URL: https://www.digikey.de/product-detail/en/murata-electronics/GRM155R70J105KA12J/490-13339-6-ND/5973468; 02. Distributor Part Number: 490-13339-6-ND; 09. Operating Temperature: -55°C ~ 125°C; 11. RoHS: YES; 01. Distributor: DigiKey; ComponentLink2Description: DataSheet; Package: 0402
C63 = C+_TAN: CAP TANT 10UF 20% 16V 1411; 04. Manufacturer: Vishay Sprague; 07. Manufacturer  Part Number: TMCHB1C106MTRF; 03. Unit Price: 0.4; 3D-Export: No; ComponentLink1Description: Info; 02. Distributor Part Number: 718-2344-1-ND; 11. RoHS: YES; 01. Distributor: DigiKey; ComponentLink2Description: DataSheet
K2-K11 = 118-1-A-5/2D: 5V Signal Relais, Normal Open; 04. Manufacturer: Pickering; 03. Unit Price: 2.60; 05. Quantity: 1000; 06. Data Sheet: Pickering_series_118.pdf; 13. Created Date/Name: 20.12.17 S. Kaiser; Coil Resistance: 1500 Ohm; Max Carry Current: 1.2 A; Max Switch Current: 1A; Max Switch Voltage: 200V; Power Rating: 15W; 01. Distributor: Pickering; 02. Distributor Part Number: 118-1-A-5/2D; 07. Manufacturer  Part Number: 118-1-A-5/2D; 09. Operating Temperature: -20°C ~ +85°C; 11. RoHS: 2011/65/EU; ComponentLink1Description: Info; ComponentLink1URL: http://www.pickeringrelay.com/; ComponentLink2Description: DataSheet; ComponentLink2URL: https://www.pickeringrelay.com/products/single-line-sil-series-111-119/single-line-sil-series-118/; Coil Voltage: 5V
Q1-Q10 = FDV303N: MOSFET N-CH 25V 680MA SOT-23; 04. Manufacturer: ON Semiconductor; 03. Unit Price: 0.41; 13. Created Date/Name: AUG 2018 / Hören; Rds On: 450 mΩ @ id=500mA & Vgs=4.5V; Vgs,th: 1.5V @ 250uA; Power Rating: 350mW; 3D-Export: No; 01. Distributor: DigiKey; 02. Distributor Part Number: FDV303NDKR-ND; 07. Manufacturer  Part Number: FDV303N; 09. Operating Temperature: -55°C ~ 150°C (TJ); 11. RoHS: YES; ComponentLink1Description: Info; ComponentLink1URL: https://www.digikey.de/product-detail/en/on-semiconductor/FDV303N/FDV303NDKR-ND/1630434; ComponentLink2Description: DataSheet; ComponentLink2URL: https://media.digikey.com/pdf/Data%20Sheets/Fairchild%20PDFs/FDV303N.pdf; Vdss: 25V; Id: 680mA
R2-R9 R14 R15 = R: RES SMD 4.7K OHM 1% 1/10W 0603; 04. Manufacturer: Yageo; 07. Manufacturer  Part Number: RC0603FR-074K7L; 03. Unit Price: 0.09; 13. Created Date/Name: AUG2018/Hören; Tolerance: ±1%; ComponentLink1URL: *; ComponentLink1Description: Info; 02. Distributor Part Number: 311-4.70KHRCT-ND; 09. Operating Temperature: -xx..+yy°C; 11. RoHS: ???; 01. Distributor: DigiKey; ComponentLink2Description: DataSheet; Package: *
R12 R114 = R: RES SMD 33 OHM 1% 1/16W 0402; 04. Manufacturer: Yageo; 07. Manufacturer  Part Number: RC0402FR-0733RL; 03. Unit Price: 0.09; 13. Created Date/Name: AUG2018/Hören; Power Rating: 0.1W; Tolerance: ±1%; ComponentLink1URL: https://www.digikey.de/product-detail/en/panasonic-electronic-components/ERJ-2RKF15R0X/P15.0LDKR-ND/575530; ComponentLink1Description: Info; 02. Distributor Part Number: 311-33.0LRDKR-ND; 09. Operating Temperature: -55°C ~ 155°C; 11. RoHS: YES; 01. Distributor: DigiKey; ComponentLink2Description: DataSheet; ComponentLink2URL: https://industrial.panasonic.com/cdbs/www-data/pdf/RDA0000/AOA0000C304.pdf; Type: Thick Film; Package: 0402
R13 = R: RES SMD 1.8K OHM 1% 1/16W 0402; 04. Manufacturer: Yageo; 07. Manufacturer  Part Number: RC0402FR-071K8L; 03. Unit Price: 0.09; 13. Created Date/Name: AUG2018/Hören; Tolerance: ±1%; ComponentLink1URL: *; ComponentLink1Description: Info; 02. Distributor Part Number: 311-1.80KLRCT-ND; 09. Operating Temperature: -xx..+yy°C; 11. RoHS: ???; 01. Distributor: DigiKey; ComponentLink2Description: DataSheet; Package: *
R109 R110 R113 = R: CRGP 2512 39K 1%; 04. Manufacturer: TE Connectivity Passive Product; 07. Manufacturer  Part Number: CRGP2512F39K; 03. Unit Price: 0.44; 13. Created Date/Name: AUG2018/Hören; Tolerance: ±1%; ComponentLink1URL: *; ComponentLink1Description: Info; 02. Distributor Part Number: A130740CT-ND; 09. Operating Temperature: -xx..+yy°C; 11. RoHS: ???; 01. Distributor: DigiKey; ComponentLink2Description: DataSheet; Package: *
R111 R112 = R: RES SMD 3.6K OHM 1% 1/10W 0603; 04. Manufacturer: Yageo; 07. Manufacturer  Part Number: RC0603FR-073K6L; 03. Unit Price: 0.09; 13. Created Date/Name: AUG2018/Hören; Tolerance: ±1%; ComponentLink1URL: *; ComponentLink1Description: Info; 02. Distributor Part Number: 311-3.60KHRCT-ND; 09. Operating Temperature: -xx..+yy°C; 11. RoHS: ???; 01. Distributor: DigiKey; ComponentLink2Description: DataSheet; Package: *
R115 = R_19: RES SMD 33 OHM 1% 1/16W 0402; 04. Manufacturer: Yageo; 07. Manufacturer  Part Number: RC0402FR-0733RL; 03. Unit Price: 0.09; 13. Created Date/Name: AUG2018/Hören; Power Rating: 63mW; Tolerance: ±1%; ComponentLink1URL: https://www.digikey.de/products/en?keywords=311-33.0LRDKR-ND; ComponentLink1Description: Info; 02. Distributor Part Number: 311-33.0LRDKR-ND; 09. Operating Temperature: -55°C ~ 155°C; 11. RoHS: YES; 01. Distributor: DigiKey; ComponentLink2Description: DataSheet; Type: Thick Film; Package: 0402
R177 = R: RES SMD 360K OHM 1% 1/4W 1206; 04. Manufacturer: Yageo; 07. Manufacturer  Part Number: RC1206FR-07360KL; 03. Unit Price: 0.09; 13. Created Date/Name: AUG2018/Hören; Tolerance: ±1%; ComponentLink1URL: *; ComponentLink1Description: Info; 02. Distributor Part Number: 311-360KFRCT-ND; 09. Operating Temperature: -xx..+yy°C; 11. RoHS: ???; 01. Distributor: DigiKey; ComponentLink2Description: DataSheet; Package: *
TP2 = DualTestpoint 100mils: Dual testpoint, pitch 2.54mm; 04. Manufacturer: Samtec Inc.; 07. Manufacturer  Part Number: HMTSW-103-07-G-S-240; 03. Unit Price: 0.25; 13. Created Date/Name: AUG2018/Hören; 01. Distributor: Samtec Inc.; 02. Distributor Part Number: HMTSW-103-07-G-S-240; 11. RoHS: YES; ComponentLink1Description: Info; ComponentLink1URL: https://www.samtec.com/products/hmtsw-103-07-g-s-240; ComponentLink2Description: DataSheet; ComponentLink2URL: http://suddendocs.samtec.com/catalog_english/hmtsw.pdf
U1 = AD8627: IC OPAMP JFET 5MHZ RRO SC70-5; 04. Manufacturer: Analog Devices Inc.; 07. Manufacturer  Part Number: AD8627AKSZ-R2; 03. Unit Price: 5.15; 13. Created Date/Name: AUG 2018 / Hören; 01. Distributor: DigiKey; 02. Distributor Part Number: AD8627AKSZ-R2DKR-ND; 09. Operating Temperature: -40°C ~ 85°C; 11. RoHS: YES; ComponentLink1Description: Info; ComponentLink1URL: https://www.digikey.de/product-detail/en/analog-devices-inc/AD8627AKSZ-R2/AD8627AKSZ-R2DKR-ND/3878640; ComponentLink2Description: DataSheet; ComponentLink2URL: http://www.analog.com/media/en/technical-documentation/data-sheets/AD8625_8626_8627.pdf; Package: SC70-5; Part: AD8627
U2 = MCP33151-10T-E/MN: 14-BIT 1 MSPS SGL CH SGL-ENDED S; 04. Manufacturer: Microchip Technology; 03. Unit Price: 4.5; 13. Created Date/Name: AUG 2018 / Hören; 01. Distributor: DigiKey; 02. Distributor Part Number: MCP33151-10T-E/MNDKR-ND; 07. Manufacturer  Part Number: MCP33151-10T-E/MN; 11. RoHS: YES; ComponentLink1Description: Info; ComponentLink1URL: https://www.digikey.de/product-detail/en/microchip-technology/MCP33151-10T-E-MN/MCP33151-10T-E-MNDKR-ND/10270414; ComponentLink2Description: DataSheet; ComponentLink2URL: http://ww1.microchip.com/downloads/en/DeviceDoc/MCP33151-XX-Family-Data-Sheet-DS20006220A.pdf; Package: 10-WFDFN Exposed Pad
U5 = LT1790BCS6-5: IC VREF SERIES 5V, 0.1% TSOT-23-6; 04. Manufacturer: Linear Technology/Analog Devices; 07. Manufacturer  Part Number: LT1790BCS6-5#TRMPBF; 03. Unit Price: 2.86; 13. Created Date/Name: AUG 2018 / Hören; 01. Distributor: DigiKey; 02. Distributor Part Number: LT1790BCS6-5#TRMPBFDKR-ND; 09. Operating Temperature: 0°C ~ 70°C (TA); 11. RoHS: YES; ComponentLink1Description: Info; ComponentLink1URL: https://www.digikey.de/product-detail/en/linear-technology-analog-devices/LT1790BCS6-5-TRMPBF/LT1790BCS6-5-TRMPBFDKR-ND/1618066; ComponentLink2Description: DataSheet; ComponentLink2URL: https://www.analog.com/media/en/technical-documentation/data-sheets/1790fc.pdf; NicName: LT1790BCS6-5
U9 = AP2138N: IC REG LINEAR 1.8V 250MA SOT23-3; 04. Manufacturer: Diodes Incorporated; 07. Manufacturer  Part Number: AP2138N-1.8TRG1; 03. Unit Price: 0.43; 01. Distributor: DigiKey; 02. Distributor Part Number: AP2138N-1.8TRG1DICT-ND; 11. RoHS: YES; ComponentLink1Description: Info; ComponentLink2Description: DataSheet

## Sheet RelayDriver.SchDoc: PCB-Tester Relay Driver
size A4 portrait; Date: JUN 2020; CheckedBy: Moerz, Hoeren; Author: Rudziński; CompanyName: TDK-Micronas GmbH; DrawnBy: Rudziński; Engineer: Rudziński; Organization: Test Engineering; Address1: Hans-Bunte-Strasse 19; Address2: D-79108 Freiburg; Address3: Germany; DocumentNumber: U33110; Revision: V1.0; SheetNumber: 8; SheetTotal: 20; DateDraw: JUN 2020; DateChecked: 2020-06-19; Workspace: Workspace; TitleTyp: Title-Typ; PageSetup: Record=PageOptions|CenterHorizontal=True|CenterVertical=True|PrintScale=0.97|XCorrection=1.00|YCorrection=1.00|PrintKind=0|BorderSize=5000000|LeftOffset=0|BottomOffset=0|Orientation=2|PaperLength=1000|PaperWidth=1000|Scale=100|PaperSource=7|PrintQuality=-3|MediaType=1|DitherType=10|PrintScaleMode=1|PaperKind=A4|PaperIndex=9
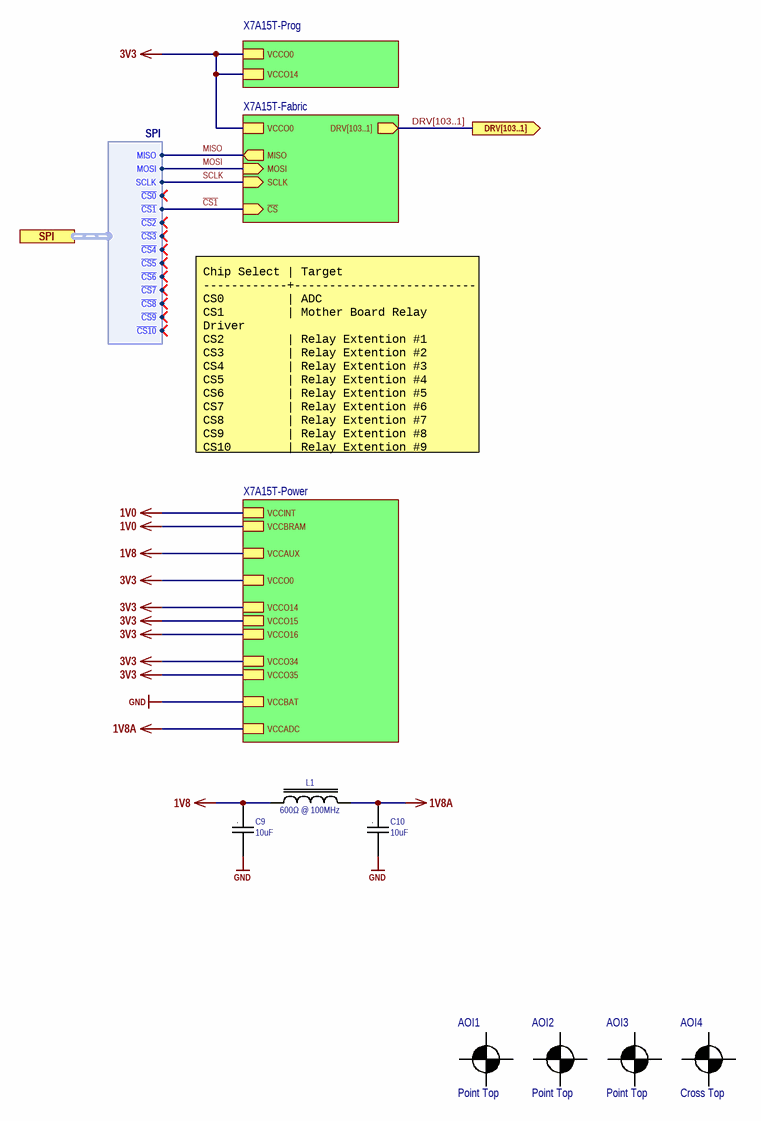
[diagram p9: RelayDriver.SchDoc]

### Parts
AOI1  Shape: Point Top  [Fiducial Point]  (hidden comment: AOI)  (no BOM)
AOI2  Shape: Point Top  [Fiducial Point]  (hidden comment: AOI)  (no BOM)
AOI3  Shape: Point Top  [Fiducial Point]  (hidden comment: AOI)  (no BOM)
AOI4  Shape: Cross Top  [Fiducial Cross]  (hidden comment: AOI)  (no BOM)
C9  value 10uF  [C0805 Reflow]  (hidden comment: C)
C10  value 10uF  [C0805 Reflow]  (hidden comment: C)
L1  Nominal Impedance: 600Ω @ 100MHz  [FB0805]  (hidden comment: L)

### Sub-sheets
X7A15T-Fabric = X7A15T-Fabric.SchDoc: SCLK (in), MISO (out), VCCO0, MOSI (in), ~{CS} (in), DRV[103..1] (out)
X7A15T-Power = X7A15T-Power.SchDoc: VCCADC, VCCO0, VCCO14, VCCO35, VCCO16, VCCAUX, VCCINT, VCCO34, VCCBRAM, VCCO15, VCCBAT
X7A15T-Prog = X7A15T-Prog.SchDoc: VCCO0, VCCO14

### Ports
DRV[103..1] (out), SPI (harness SPI)

### Harnesses
SPI: MISO, MOSI, SCLK, ~{CS0}, ~{CS1}, ~{CS2}, ~{CS3}, ~{CS4}, ~{CS5}, ~{CS6}, ~{CS7}, ~{CS8}, ~{CS9}, ~{CS10}

### Nets
1V0: sheet X7A15T-Power/VCCINT, sheet X7A15T-Power/VCCBRAM
1V8: C9.1 L1.1 ; sheet X7A15T-Power/VCCAUX
1V8A: C10.1 L1.2 ; sheet X7A15T-Power/VCCADC
3V3: sheet X7A15T-Prog/VCCO0, sheet X7A15T-Prog/VCCO14, sheet X7A15T-Fabric/VCCO0, sheet X7A15T-Power/VCCO0, sheet X7A15T-Power/VCCO14, sheet X7A15T-Power/VCCO35, sheet X7A15T-Power/VCCO16, sheet X7A15T-Power/VCCO34, sheet X7A15T-Power/VCCO15
GND: C9.2 C10.2 ; sheet X7A15T-Power/VCCBAT
~{CS1}: sheet X7A15T-Fabric/~{CS}, port SPI.~{CS1}
MISO: sheet X7A15T-Fabric/MISO, port SPI.MISO
MOSI: sheet X7A15T-Fabric/MOSI, port SPI.MOSI
SCLK: sheet X7A15T-Fabric/SCLK, port SPI.SCLK

### Buses and harness runs
bus DRV[103..1] = port DRV[103..1] = sheet X7A15T-Fabric/DRV[103..1]

### Notes on the sheet
- Chip Select | Target
  ------------+--------------------------
  CS0         | ADC
  CS1         | Mother Board Relay Driver
  CS2         | Relay Extention #1
  CS3         | Relay Extention #2
  CS4         | Relay Extention #3
  CS5         | Relay Extention #4
  CS6         | Relay Extention #5
  CS7         | Relay Extention #6
  CS8         | Relay Extention #7
  CS9         | Relay Extention #8
  CS10        | Relay Extention #9
- designed by
- reviewed by
- last drawn by
- Project:
- Schematic:
- last printed
- DIN-A4 P
- sheets
- of
- File:
- (in symbol C) .

### Library data of the parts
AOI1-AOI4 = Fiducial: Assembly AOI; 13. Created Date/Name: AUG2018/Hören; 01. Distributor: N/A; 02. Distributor Part Number: N/A; 03. Unit Price: N/A; 04. Manufacturer: N/A; 05. Quantity: N/A; 06. Data Sheet: N/A; 07. Manufacturer  Part Number: N/A; 08. Inhouse Stock: N/A; 09. Operating Temperature: N/A; 10. Weight: N/A; 11. RoHS: N/A; 12.UL94 Flammability: N/A; ComponentLink1Description: Info; ComponentLink2Description: Info
C9 C10 = C: CAP CER 10UF 10V X7R 0805; 04. Manufacturer: Samsung Electro-Mechanics; 07. Manufacturer  Part Number: CL21B106KPQNNNE; Tolerance: ±10%; 03. Unit Price: 0.24; 13. Created Date/Name: AUG2018/Hören; Voltage Rating: 10V; Type: X7R; ComponentLink1Description: Info; ComponentLink1URL: https://www.digikey.de/products/en?keywords=1276-1764-6-ND; 02. Distributor Part Number: 1276-1764-6-ND; 09. Operating Temperature: -55°C ~ 125°C; 11. RoHS: YES; 01. Distributor: DigiKey; ComponentLink2Description: DataSheet; Package: 0805
L1 = FB: FERRITE BEAD 600 OHM 0805 1LN; 04. Manufacturer: Würth Elektronik; 07. Manufacturer  Part Number: 742792040; DCR: 150mΩ; Impedance Tolerance: %; 03. Unit Price: 0.22; 13. Created Date/Name: AUG2018/Hören; IRMS: 2A; ComponentLink1Description: Info; ComponentLink1URL: https://www.digikey.de/products/en?keywords=732-1620-6-ND; ComponentLink2Description: DataSheet; ComponentLink2URL: https://www.we-online.de/katalog/datasheet/742792040.pdf; 02. Distributor Part Number: 732-1620-6-ND; 09. Operating Temperature: -55°C ~ 125°C; 11. RoHS: YES; 01. Distributor: DigiKey; ISAT: *; Package: 0805; Tolerance: *; Value: *